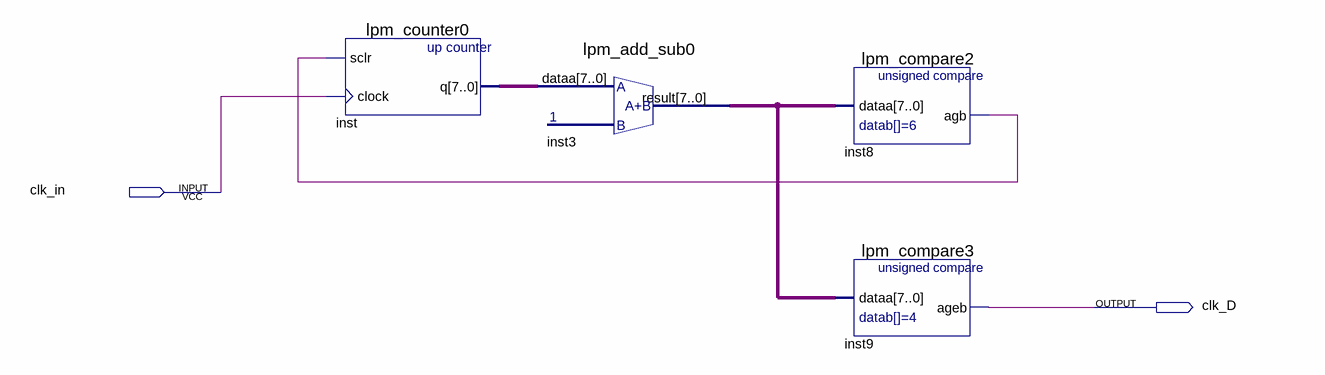
[diagram p0: schematic sheet]
// Quartus schematic Block2.bdf as structural Verilog: 4 symbols, 2 pins
module Block2 (
  input  clk_in,
  output clk_D
);

  wire inst8_agb;
  wire [7:0] inst3_result, inst_q;

  lpm_counter0 inst (.sclr(inst8_agb), .clock(clk_in), .q(inst_q));
  lpm_add_sub0 inst3 (.dataa(inst_q), .result(inst3_result));
  lpm_compare2 inst8 (.dataa(inst3_result), .agb(inst8_agb));
  lpm_compare3 inst9 (.dataa(inst3_result), .ageb(clk_D));
endmodule
